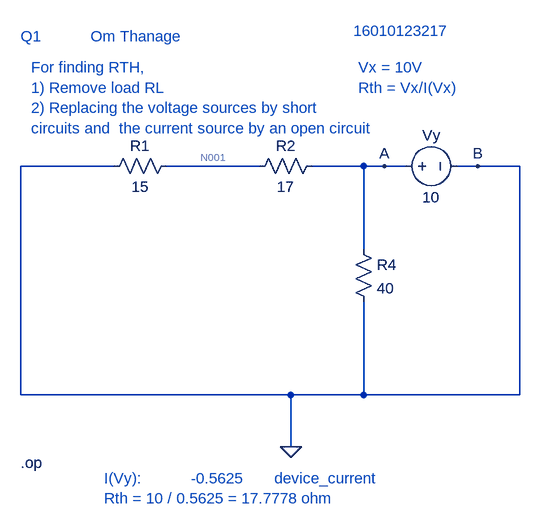
[diagram p0: schematic Rth.asc]
Rth.asc, the LTspice schematic file:
Version 4
SHEET 1 880 780
WIRE -1648 256 -1792 256
WIRE -1424 256 -1568 256
WIRE -1264 256 -1344 256
WIRE -1232 256 -1264 256
WIRE -1200 256 -1232 256
WIRE -1088 256 -1120 256
WIRE -1024 256 -1088 256
WIRE -1264 384 -1264 256
WIRE -1792 608 -1792 256
WIRE -1376 608 -1792 608
WIRE -1264 608 -1264 464
WIRE -1264 608 -1376 608
WIRE -1024 608 -1024 256
WIRE -1024 608 -1264 608
WIRE -1376 688 -1376 608
FLAG -1376 688 0
FLAG -1232 256 A
FLAG -1088 256 B
SYMBOL res -1552 240 R90
WINDOW 0 0 56 VBottom 2
WINDOW 3 32 56 VTop 2
SYMATTR InstName R1
SYMATTR Value 15
SYMBOL res -1328 240 R90
WINDOW 0 0 56 VBottom 2
WINDOW 3 32 56 VTop 2
SYMATTR InstName R2
SYMATTR Value 17
SYMBOL res -1280 368 R0
SYMATTR InstName R4
SYMATTR Value 40
SYMBOL voltage -1216 256 R270
WINDOW 0 32 56 VTop 2
WINDOW 3 -32 56 VBottom 2
WINDOW 123 0 0 Left 0
WINDOW 39 0 0 Left 0
SYMATTR InstName Vy
SYMATTR Value 10
TEXT -1792 712 Left 2 !.op
TEXT -1792 56 Left 2 ;Q1           Om Thanage
TEXT -1280 48 Left 2 ;16010123217
TEXT -1776 104 Left 2 ;For finding RTH,\n1) Remove load RL\n2) Replacing the voltage sources by short\ncircuits and  the current source by an open circuit
TEXT -1272 104 Left 2 ;Vx = 10V\nRth = Vx/I(Vx)
TEXT -1664 736 Left 2 ;I(Vy):           -0.5625       device_current\nRth = 10 / 0.5625 = 17.7778 ohm

The netlist it stands for:
* Rth.asc
R1 N001 0 15
R2 A N001 17
R4 A 0 40
Vy A 0 10
.op
* Q1           Om Thanage
* 16010123217
* For finding RTH,
* 1) Remove load RL
* 2) Replacing the voltage sources by short
* circuits and  the current source by an open circuit
* Vx = 10V
* Rth = Vx/I(Vx)
* I(Vy):           -0.5625       device_current
* Rth = 10 / 0.5625 = 17.7778 ohm
.backanno
.end

* Results of the author's LTspice run, read from the files saved beside the schematic
* Operating Point:
*   V(n001) = 4.688 V
*   V(a) = 10 V
*   I(R1) = 312.5 mA
*   I(R2) = 312.5 mA
*   I(R4) = 250 mA
*   I(Vy) = -562.5 mA